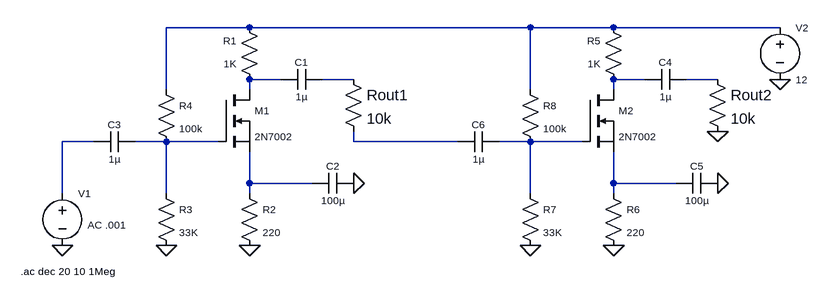
[diagram p0: schematic two_stage.asc]
two_stage.asc, the LTspice schematic file:
Version 4.1
SHEET 1 1232 680
WIRE 368 96 240 96
WIRE 800 96 368 96
WIRE 928 96 800 96
WIRE 1184 96 928 96
WIRE 416 176 368 176
WIRE 528 176 480 176
WIRE 976 176 928 176
WIRE 1088 176 1040 176
WIRE 240 192 240 96
WIRE 368 192 368 176
WIRE 800 192 800 96
WIRE 928 192 928 176
WIRE 128 272 80 272
WIRE 240 272 192 272
WIRE 320 272 240 272
WIRE 528 272 528 256
WIRE 688 272 528 272
WIRE 800 272 752 272
WIRE 880 272 800 272
WIRE 368 336 368 288
WIRE 464 336 368 336
WIRE 928 336 928 288
WIRE 1024 336 928 336
WIRE 80 352 80 272
WIRE 240 352 240 272
WIRE 368 352 368 336
WIRE 800 352 800 272
WIRE 928 352 928 336
FLAG 368 432 0
FLAG 240 432 0
FLAG 80 432 0
FLAG 528 336 0
FLAG 928 432 0
FLAG 800 432 0
FLAG 1184 176 0
FLAG 1088 336 0
FLAG 1088 256 0
SYMBOL nmos 320 192 R0
WINDOW 0 56 32 Left 1
WINDOW 3 56 72 Left 1
SYMATTR InstName M1
SYMATTR Value 2N7002
SYMBOL res 384 192 R180
WINDOW 0 36 76 Left 1
WINDOW 3 36 40 Left 1
SYMATTR InstName R1
SYMATTR Value 1K
SYMBOL cap 480 160 R90
WINDOW 0 0 32 VBottom 1
WINDOW 3 32 32 VTop 1
SYMATTR InstName C1
SYMATTR Value 1µ
SYMATTR SpiceLine V=16 Irms=0 Rser=11 Lser=0 mfg="AVX" pn="TAJA105K016" type="Tantalum"
SYMBOL cap 528 320 R90
WINDOW 0 0 32 VBottom 1
WINDOW 3 32 32 VTop 1
SYMATTR InstName C2
SYMATTR Value 100µ
SYMATTR SpiceLine V=16 Irms=0 Rser=11 Lser=0 mfg="AVX" pn="TAJA105K016" type="Tantalum"
SYMBOL res 352 336 R0
WINDOW 0 36 40 Left 1
WINDOW 3 36 76 Left 1
SYMATTR InstName R2
SYMATTR Value 220
SYMBOL res 224 336 R0
WINDOW 0 36 40 Left 1
WINDOW 3 36 76 Left 1
SYMATTR InstName R3
SYMATTR Value 33K
SYMBOL res 224 176 R0
WINDOW 0 36 40 Left 1
WINDOW 3 36 76 Left 1
SYMATTR InstName R4
SYMATTR Value 100k
SYMBOL cap 192 256 R90
WINDOW 0 0 32 VBottom 1
WINDOW 3 32 32 VTop 1
SYMATTR InstName C3
SYMATTR Value 1µ
SYMATTR SpiceLine V=16 Irms=0 Rser=11 Lser=0 mfg="AVX" pn="TAJA105K016" type="Tantalum"
SYMBOL voltage 80 336 R0
WINDOW 123 39 64 Left 1
WINDOW 39 0 0 Left 0
WINDOW 0 24 16 Left 1
SYMATTR Value2 AC .001
SYMATTR InstName V1
SYMATTR Value ""
SYMBOL res 512 160 R0
SYMATTR InstName Rout1
SYMATTR Value 10k
SYMBOL nmos 880 192 R0
WINDOW 0 56 32 Left 1
WINDOW 3 56 72 Left 1
SYMATTR InstName M2
SYMATTR Value 2N7002
SYMBOL res 944 192 R180
WINDOW 0 36 76 Left 1
WINDOW 3 36 40 Left 1
SYMATTR InstName R5
SYMATTR Value 1K
SYMBOL cap 1040 160 R90
WINDOW 0 0 32 VBottom 1
WINDOW 3 32 32 VTop 1
SYMATTR InstName C4
SYMATTR Value 1µ
SYMATTR SpiceLine V=16 Irms=0 Rser=11 Lser=0 mfg="AVX" pn="TAJA105K016" type="Tantalum"
SYMBOL cap 1088 320 R90
WINDOW 0 0 32 VBottom 1
WINDOW 3 32 32 VTop 1
SYMATTR InstName C5
SYMATTR Value 100µ
SYMATTR SpiceLine V=16 Irms=0 Rser=11 Lser=0 mfg="AVX" pn="TAJA105K016" type="Tantalum"
SYMBOL res 912 336 R0
WINDOW 0 36 40 Left 1
WINDOW 3 36 76 Left 1
SYMATTR InstName R6
SYMATTR Value 220
SYMBOL res 784 336 R0
WINDOW 0 36 40 Left 1
WINDOW 3 36 76 Left 1
SYMATTR InstName R7
SYMATTR Value 33K
SYMBOL res 784 176 R0
WINDOW 0 36 40 Left 1
WINDOW 3 36 76 Left 1
SYMATTR InstName R8
SYMATTR Value 100k
SYMBOL cap 752 256 R90
WINDOW 0 0 32 VBottom 1
WINDOW 3 32 32 VTop 1
SYMATTR InstName C6
SYMATTR Value 1µ
SYMATTR SpiceLine V=16 Irms=0 Rser=11 Lser=0 mfg="AVX" pn="TAJA105K016" type="Tantalum"
SYMBOL voltage 1184 80 R0
WINDOW 123 0 0 Left 0
WINDOW 39 0 0 Left 0
WINDOW 0 24 16 Left 1
WINDOW 3 24 96 Left 1
SYMATTR InstName V2
SYMATTR Value 12
SYMBOL res 1072 160 R0
SYMATTR InstName Rout2
SYMATTR Value 10k
TEXT 16 472 Left 1 !.ac dec 20 10 1Meg

The netlist it stands for:
* two_stage.asc
M1 N002 N007 N010 N010 2N7002
R1 N002 N001 1K
C1 N003 N002 1µ V=16 Irms=0 Rser=11 Lser=0 mfg="AVX" pn="TAJA105K016" type="Tantalum"
C2 0 N010 100µ V=16 Irms=0 Rser=11 Lser=0 mfg="AVX" pn="TAJA105K016" type="Tantalum"
R2 N010 0 220
R3 N007 0 33K
R4 N001 N007 100k
C3 N007 N006 1µ V=16 Irms=0 Rser=11 Lser=0 mfg="AVX" pn="TAJA105K016" type="Tantalum"
V1 N006 0 AC .001
Rout1 N003 N008 10k
M2 N004 N009 N011 N011 2N7002
R5 N004 N001 1K
C4 N005 N004 1µ V=16 Irms=0 Rser=11 Lser=0 mfg="AVX" pn="TAJA105K016" type="Tantalum"
C5 0 N011 100µ V=16 Irms=0 Rser=11 Lser=0 mfg="AVX" pn="TAJA105K016" type="Tantalum"
R6 N011 0 220
R7 N009 0 33K
R8 N001 N009 100k
C6 N009 N008 1µ V=16 Irms=0 Rser=11 Lser=0 mfg="AVX" pn="TAJA105K016" type="Tantalum"
V2 N001 0 12
Rout2 N005 0 10k
.model NMOS NMOS
.model PMOS PMOS
.lib standard.mos
.ac dec 20 10 1Meg
.backanno
.end